# EAGLE schematic LineSensorAdapter (EAGLE 6.6.0)
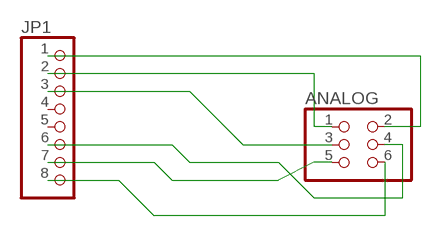
[diagram p0: schematic, sheet 1]

## Parts
ANALOG  PINHD-2X3  [2X03]
JP1  PINHD-1X8BIG  [1X08-BIG]

## Nets
A0: ANALOG.3 JP1.3
A1: ANALOG.4 JP1.6
A2: ANALOG.5 JP1.7
A3: ANALOG.6 JP1.8
GND: ANALOG.2 JP1.1
VCC: ANALOG.1 JP1.2
Unconnected: JP1.4 JP1.5

## Library data of the parts
ANALOG = pinhead:PINHD-2X3: PIN HEADER
JP1 = adafruit:PINHD-1X8: PIN HEADER